# EAGLE design Lights-ctrl rev02 (EAGLE 9.6.2)
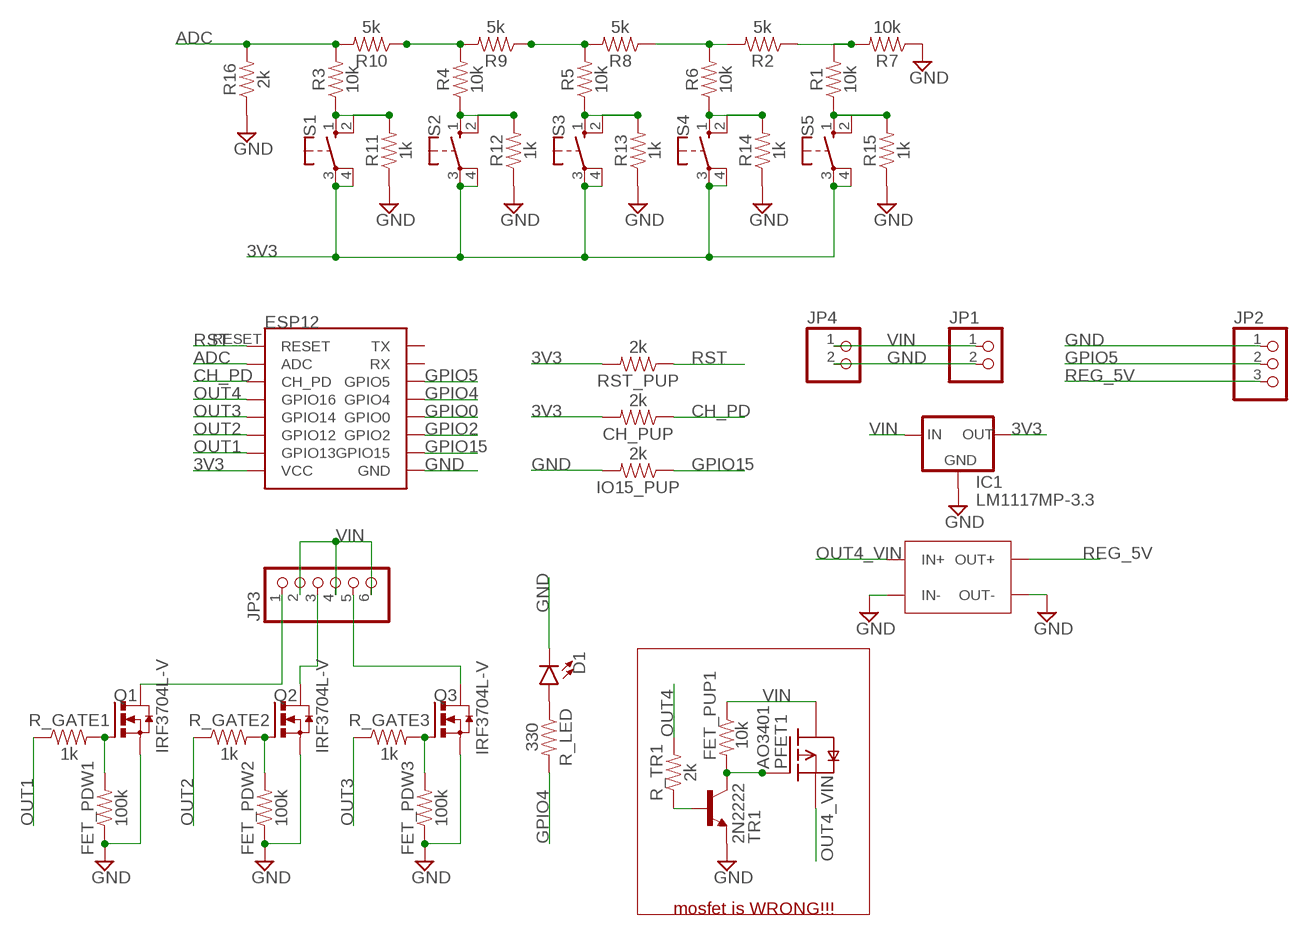
[diagram p0: schematic, sheet 1]

## Parts
CH_PUP  2k  200KOHM-0603-1/10W-1%  [0603]
D1  LED5MM-KIT  [LED_5MM-KIT]
FET_PDW1  100k  200KOHM-0603-1/10W-1%  [0603]
FET_PDW2  100k  200KOHM-0603-1/10W-1%  [0603]
FET_PDW3  100k  200KOHM-0603-1/10W-1%  [0603]
FET_PUP1  10k  200KOHM-0603-1/10W-1%  [0603]
IC1  LM1117MP-3.3  [SOT223]
IO15_PUP  2k  200KOHM-0603-1/10W-1%  [0603]
JP1  PINHD-1X2  [1X02]
JP2  PINHD-1X3  [1X03]
JP3  PINHD-1X6/90  [1X06/90]
JP4  PINHD-1X2  [1X02]
PFET1  AO3401  [SOT23-3]
Q1  IRF3704L-V  [TO262-V]
Q2  IRF3704L-V  [TO262-V]
Q3  IRF3704L-V  [TO262-V]
R1  10k  200KOHM-0603-1/10W-1%  [0603]
R2  5k  200KOHM-0603-1/10W-1%  [0603]
R3  10k  200KOHM-0603-1/10W-1%  [0603]
R4  10k  200KOHM-0603-1/10W-1%  [0603]
R5  10k  200KOHM-0603-1/10W-1%  [0603]
R6  10k  200KOHM-0603-1/10W-1%  [0603]
R7  10k  200KOHM-0603-1/10W-1%  [0603]
R8  5k  200KOHM-0603-1/10W-1%  [0603]
R9  5k  200KOHM-0603-1/10W-1%  [0603]
R10  5k  200KOHM-0603-1/10W-1%  [0603]
R11  1k  200KOHM-0603-1/10W-1%  [0603]
R12  1k  200KOHM-0603-1/10W-1%  [0603]
R13  1k  200KOHM-0603-1/10W-1%  [0603]
R14  1k  200KOHM-0603-1/10W-1%  [0603]
R15  1k  200KOHM-0603-1/10W-1%  [0603]
R16  2k  200KOHM-0603-1/10W-1%  [0603]
R_GATE1  1k  200KOHM-0603-1/10W-1%  [0603]
R_GATE2  1k  200KOHM-0603-1/10W-1%  [0603]
R_GATE3  1k  200KOHM-0603-1/10W-1%  [0603]
R_LED  330  200KOHM-0603-1/10W-1%  [0603]
R_TR1  2k  200KOHM-0603-1/10W-1%  [0603]
RST_PUP  2k  200KOHM-0603-1/10W-1%  [0603]
S1  10-XX  [B3F-10XX]
S2  10-XX  [B3F-10XX]
S3  10-XX  [B3F-10XX]
S4  10-XX  [B3F-10XX]
S5  10-XX  [B3F-10XX]
TR1  2N2222  [SOT23-BEC]
U$1  ESP12E-CASTELLATED  [ESP12E-CASTELLATED]
U$4  XL4005  [XL4005]

## Nets
3V3: CH_PUP.2 IC1.2(OUT) IC1.4(OUT) RST_PUP.2 S1.3(P) S1.4(P1) S2.3(P) S2.4(P1) S3.3(P) S3.4(P1) S4.3(P) S4.4(P1) S5.3(P) S5.4(P1) U$1.VCC
ADC: R3.2 R10.2 R16.2 U$1.ADC
CH_PD: CH_PUP.1 U$1.CH_PD
GND: D1.K(C) FET_PDW1.1 FET_PDW2.1 FET_PDW3.1 IC1.1(GND) IO15_PUP.2 JP1.2 JP2.1 JP4.2 Q1.3(S) Q2.3(S) Q3.3(S) R7.1 R11.1 R12.1 R13.1 R14.1 R15.1 R16.1 TR1.E U$1.GND U$4.IN- U$4.OUT-
GPIO0: U$1.GPIO0
GPIO2: U$1.GPIO2
GPIO4: R_LED.2 U$1.GPIO4
GPIO5: JP2.2 U$1.GPIO5
GPIO15: IO15_PUP.1 U$1.GPIO15
N$1: JP3.1 Q1.2(D)
N$2: R2.2 R6.2 R8.1
N$3: R5.2 R8.2 R9.1
N$4: R4.2 R9.2 R10.1
N$5: D1.A R_LED.1
N$6: R3.1 R11.2 S1.1(S) S1.2(S1)
N$7: R_TR1.1 TR1.B
N$8: FET_PUP1.2 PFET1.1(G) TR1.C
N$10: R1.1 R15.2 S5.1(S) S5.2(S1)
N$12: JP3.3 Q2.2(D)
N$13: JP3.5 Q3.2(D)
N$15: FET_PDW1.2 Q1.1(G) R_GATE1.2
N$16: R1.2 R2.1 R7.2
N$17: R4.1 R12.2 S2.1(S) S2.2(S1)
N$18: FET_PDW2.2 Q2.1(G) R_GATE2.2
N$19: FET_PDW3.2 Q3.1(G) R_GATE3.2
N$20: R5.1 R13.2 S3.1(S) S3.2(S1)
N$21: R6.1 R14.2 S4.1(S) S4.2(S1)
OUT1: R_GATE1.1 U$1.GPIO13
OUT2: R_GATE2.1 U$1.GPIO12
OUT3: R_GATE3.1 U$1.GPIO14
OUT4: R_TR1.2 U$1.GPIO16
OUT4_VIN: PFET1.2(S) U$4.IN+
REG_5V: JP2.3 U$4.OUT+
RST: RST_PUP.1 U$1.RESET
VIN: FET_PUP1.1 IC1.3(IN) JP1.1 JP3.2 JP3.4 JP3.6 JP4.1 PFET1.3(D)
Unconnected: U$1.RX U$1.TX

## Notes on the sheet
- mosfet is WRONG!!!

## Library data of the parts
CH_PUP FET_PDW1-FET_PDW3 FET_PUP1 IO15_PUP R1-R16 R_GATE1-R_GATE3 R_LED R_TR1 RST_PUP = SparkFun-Resistors:200KOHM: 200kΩ resistor A resistor is a passive two-terminal electrical component that implements electrical resistance as a circuit element. Resistors act to reduce current flow, and, at the same time, act to lower voltage levels within circuits. - Wikipedia; PROD_ID: RES-09385; VALUE: 200k
D1 = SparkFun-LED:LED: LED (Generic) Standard schematic elements and footprints for 5mm, 3mm, 1206, and 0603 sized LEDs. Generic LEDs with no color specified.
IC1 = lm1117_10:LM1117?-*: 800mA Low-Dropout Linear Regulator Source: http://www.ti.com/lit/ds/symlink/lm1117-n.pdf; MF: Texas Instruments; MPN: LM1117MP-3.3; OC_FARNELL: 9778195; OC_NEWARK: 28X3416
JP1 JP4 = pinhead:PINHD-1X2: PIN HEADER
JP2 = pinhead:PINHD-1X3: PIN HEADER
JP3 = pinhead:PINHD-1X6: PIN HEADER
PFET1 = AO3401:AO3401: 30V N-Channel MOSFET The AO3404 uses advanced trench technology to provide excellent RDS(ON) and low gate charge. This device may be used as a load switch or in PWM applications. Maximum ratings: Drain-Source Voltage: 30V Gate-Source Voltage: +-20V Continuous Drain Current: 5 (25 C) / 4 (70 C) A Gate Threshold Voltage: 1.2 - 2.4 V Check prices <https://pricing.snapeda.com/parts/AO3401/Alpha%20%26%20Omega%20Semiconductor/view-part?ref=eda>; AVAILABILITY: Bad; DESCRIPTION: P-Channel 30V 4A (Ta) 1.4W (Ta) Surface Mount SOT-23-3L; MF: Alpha & Omega Semiconductor; MP: AO3401; PACKAGE: SOT-23-3 Alpha &amp; Omega Semiconductor; PRICE: None
Q1-Q3 = transistor-power:IRF3704: SMPS MOSFET HEXFET® Power MOSFET Source: http://www.irf.com/product-info/datasheets/data/irf3704.pdf
S1-S5 = switch-omron:10-XX: OMRON SWITCH; MPN: B3F-1000; OC_FARNELL: 176432; OC_NEWARK: 36M3542
TR1 = gabriel:2N2222
U$1 = gabriel:ESP12E-CASTELLATED
U$4 = gabriel:XL4005

## Board
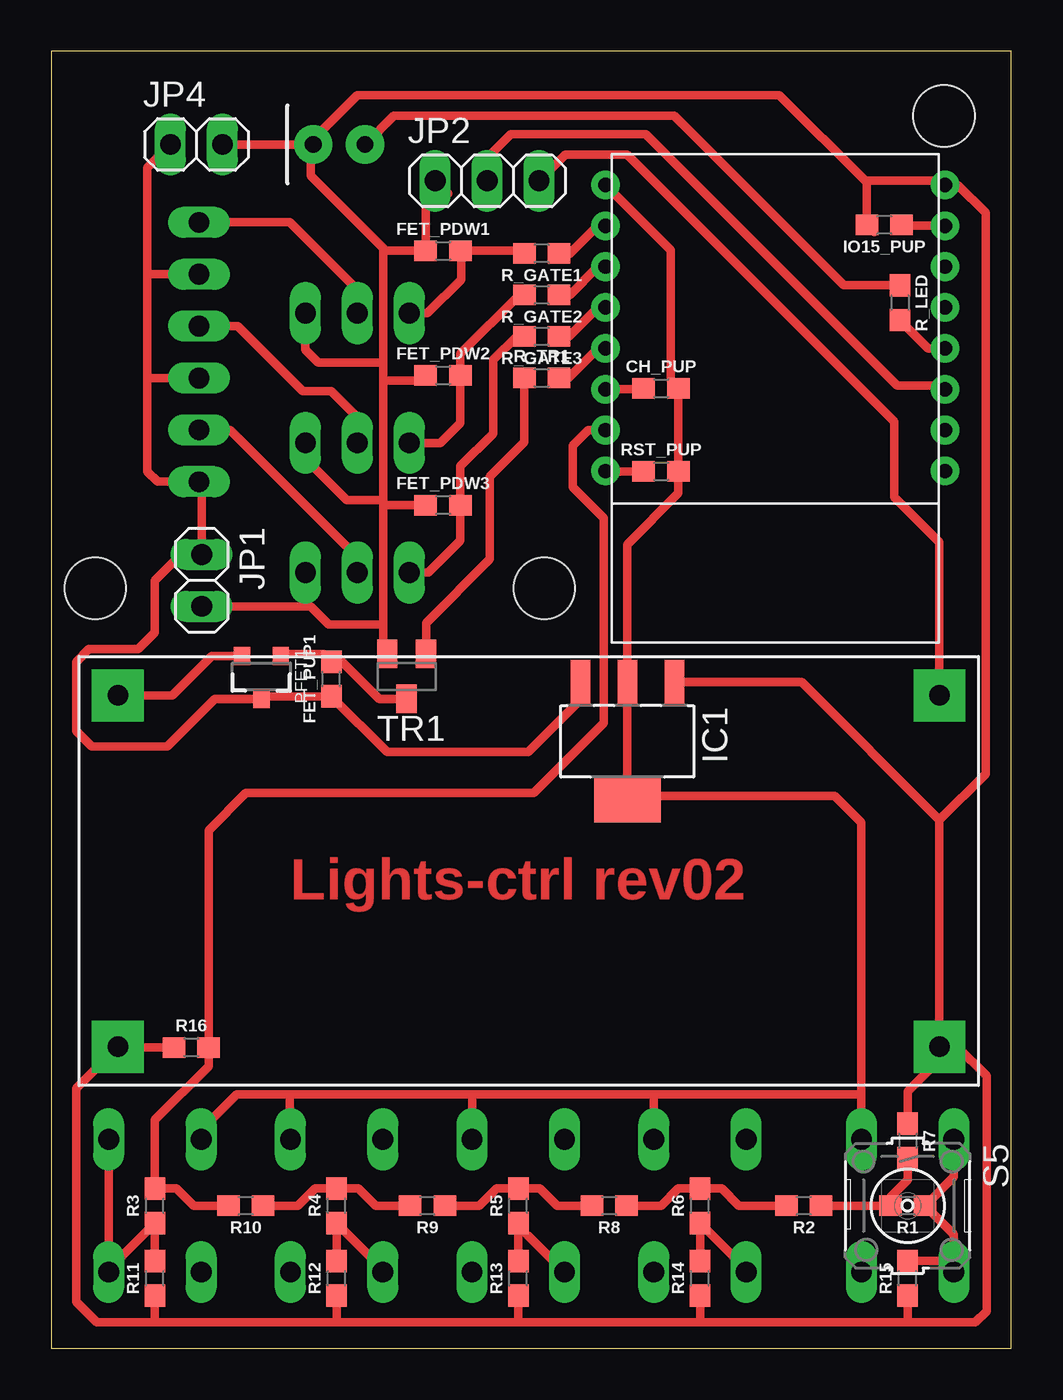
[diagram p1: board, top side]
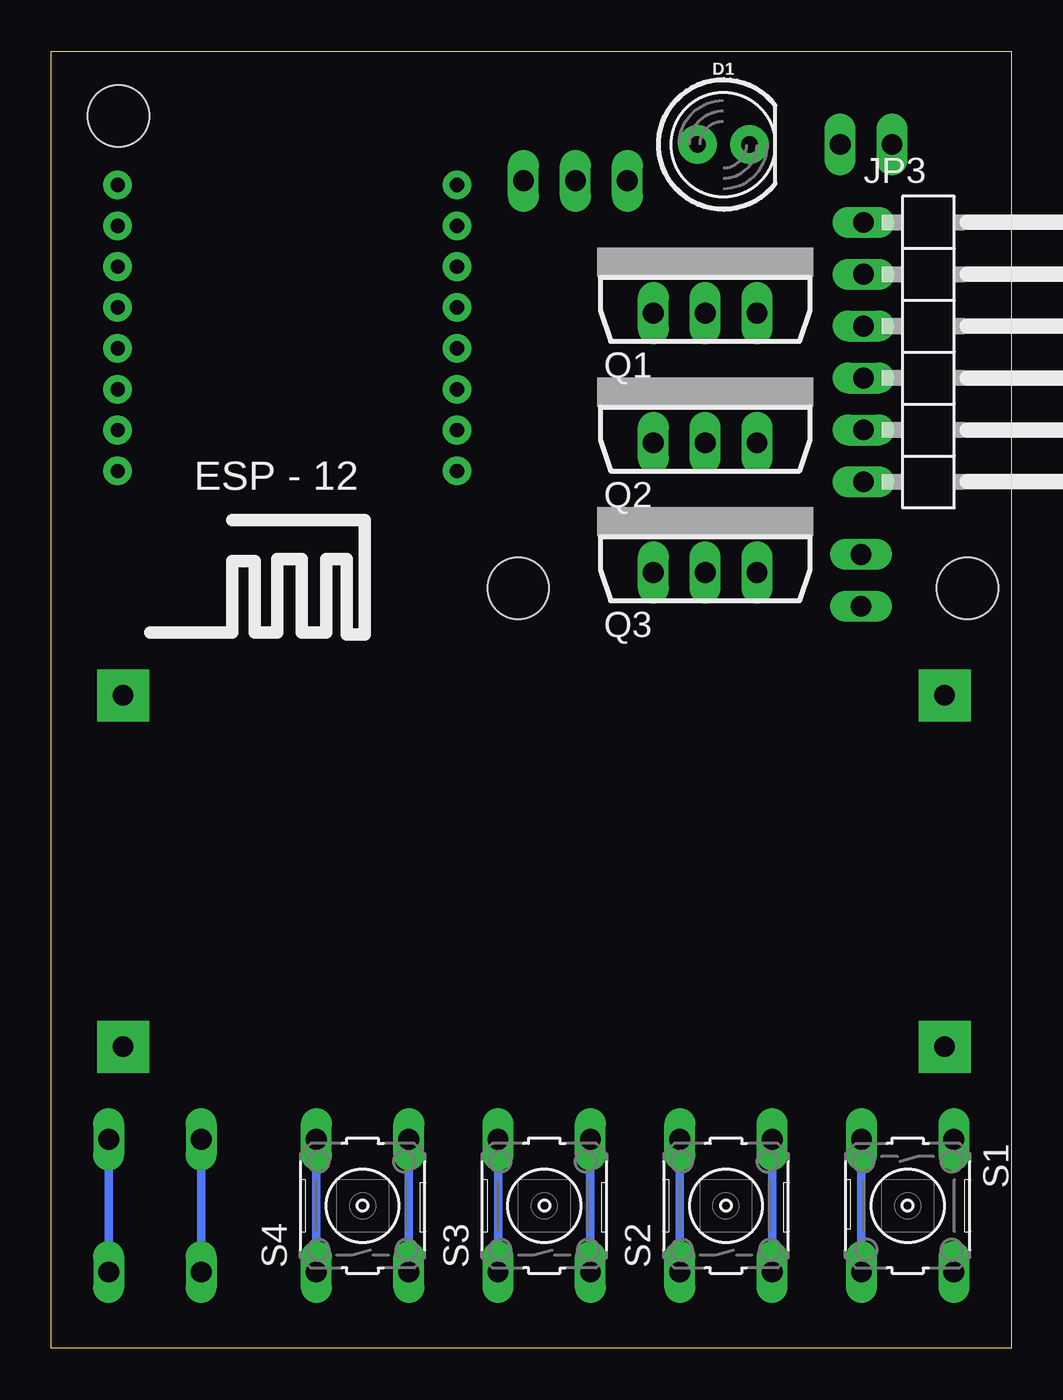
[diagram p2: board, bottom side, seen from below]

Size 46.99 x 63.5 mm. Coordinates in mm from the lower left corner, seen from the top.
Outline: 0,0 46.99,0 46.99,63.5 0,63.5 0,0
Copper layers (1*16): Top 0.035mm / dielectric 1.5mm / Bottom 0.035mm
Design rules "default": minimum track width 6mil, minimum drill 0.35mm, track to track 6mil, track to pad 6mil, pad to pad 6mil, via to via 6mil, smd to smd 6mil, copper to edge 40mil, drill to drill 6mil, minimum pad ring 10mil, minimum via ring 8mil, stop-mask expansion 4mil, vias tented up to drill 0mil, thermal gap 10mil
Holes 3 mm at 24.13,37.21 43.69,60.33 2.16,37.21

### Footprints (pad centres in the part's own frame; a part is rotated, then mirrored left to right if it is on the bottom)
0603 = smd 1.1 x 1: 1 -0.85,0; 2 0.85,0
LED_5MM-KIT = drill 0.813 pad 1.88: A -1.27,0; K 1.27,0
SOT223 = smd 0.95 x 2.15: 1 -2.3,-2.9; 2 0,-2.9; 3 2.3,-2.9 | smd 3.25 x 2.15: 4 0,2.9
1X02 = drill 1.016 long: 1 -1.27,0; 2 1.27,0
1X03 = drill 1.016 long: 1 -2.54,0; 2 0,0; 3 2.54,0
1X06/90 = drill 1.016 long: 1 -6.35,-3.81; 2 -3.81,-3.81; 3 -1.27,-3.81; 4 1.27,-3.81; 5 3.81,-3.81; 6 6.35,-3.81
SOT23-3 = smd 0.8 x 0.9: 1 -0.95,-1; 2 0.95,-1; 3 0,1.1
TO262-V = drill 1.016 long: 1 -2.54,0; 2 0,0; 3 2.54,0
B3F-10XX = drill 1.016 long: 1 -3.251,2.261; 2 3.251,2.261; 3 -3.251,-2.261; 4 3.251,-2.261
SOT23-BEC = smd 1 x 1.4: B -0.95,-1.1; C 0,1.1; E 0.95,-1.1
ESP12E-CASTELLATED = drill 0.7 pad 1.4: ADC -8.3,0.9; CH_PD -8.3,-1.1; GND 8.3,-11.1; GPIO0 8.3,-5.1; GPIO2 8.3,-7.1; GPIO4 8.3,-3.1; GPIO5 8.3,-1.1; GPIO12 -8.3,-7.1; GPIO13 -8.3,-9.1; GPIO14 -8.3,-5.1; GPIO15 8.3,-9.1; GPIO16 -8.3,-3.1; RESET -8.3,2.9; RX 8.3,0.9; TX 8.3,2.9; VCC -8.3,-11.1
XL4005 = drill 1 pad 2.54 square: IN+ -20.1,8.6; IN- -20.1,-8.6; OUT+ 20.1,8.6; OUT- 20.1,-8.6

### Placement (x,y rotation side)
CH_PUP  29.84,46.99 0 top
D1  14.1,58.93 0 bottom
FET_PDW1  19.18,53.72 0 top
FET_PDW2  19.18,47.62 0 top
FET_PDW3  19.18,41.27 0 top
FET_PUP1  13.72,32.77 90 top
IC1  28.19,29.72 180 top
IO15_PUP  40.77,54.99 180 top
JP1  7.37,37.59 270 top
JP2  21.34,57.15 0 top
JP3  3.43,48.77 270 bottom
JP4  7.11,58.93 0 top
PFET1  10.29,32.89 180 top
Q1  14.99,50.67 0 bottom
Q2  14.99,44.32 0 bottom
Q3  14.99,37.97 0 bottom
R1  41.91,6.99 180 top
R2  36.83,6.99 180 top
R3  5.08,6.99 90 top
R4  13.97,6.99 90 top
R5  22.86,6.99 90 top
R6  31.75,6.99 90 top
R7  41.91,10.16 270 top
R8  27.3,6.99 180 top
R9  18.41,6.99 180 top
R10  9.53,6.99 180 top
R11  5.08,3.43 90 top
R12  13.97,3.43 90 top
R13  22.86,3.43 90 top
R14  31.75,3.43 90 top
R15  41.91,3.43 90 top
R16  6.86,14.73 0 top
R_GATE1  24,53.59 180 top
R_GATE2  24,51.56 180 top
R_GATE3  24,49.53 180 top
R_LED  41.53,51.18 270 top
R_TR1  24,47.5 0 top
RST_PUP  29.84,42.93 0 top
S1  5.08,6.99 270 bottom
S2  13.97,6.99 90 bottom
S3  22.86,6.99 90 bottom
S4  31.75,6.99 90 bottom
S5  41.91,6.99 270 top
TR1  17.4,32.89 180 top
U$1  35.43,45.85 180 bottom
U$4  23.37,23.37 0 top

### Tracks (layer width: path | path; a pad name or v marks a point on that pad's centre or on a via)
3V3
  Top 0.406: U$1.VCC 30.31,53.77 30.31,47.37 CH_PUP.2 RST_PUP.2 30.7,41.86 28.19,39.36 IC1.2 IC1.4 28.43,27.05 38.35,27.05 39.65,25.76 39.65,12.45 | 12.14,10.24 S2.4 11.68,10.26 11.68,12.45 | S1.3 7.11,10.46 9.09,12.45 11.68,12.45 | S5.3 39.65,12.45 | 29.49,10.26 S4.4 29.49,12.42 29.46,12.45 | 39.65,12.45 29.46,12.45 | 20.6,12.45 11.68,12.45 | S3.4 20.6,12.45 | 29.46,12.45 20.6,12.45
  Bottom 0.406: S3.4 S3.3 | S4.4 S4.3 | S2.4 S2.3 | S5.3 S5.4 | S1.3 S1.4
ADC
  Top 0.406: U$1.ADC 27.05,44.95 27.04,44.96 26.29,44.96 25.53,44.2 25.53,42.16 27.05,40.64 27.05,30.61 23.62,27.18 9.53,27.18 7.71,25.36 R16.2 7.71,13.8 5.08,11.18 R3.2 6.13,7.83 6.99,6.99 R10.2
CH_PD
  Top 0.406: CH_PUP.1 28.95,46.95 U$1.CH_PD
GND
  Top 0.406: IO15_PUP.2 40.27,54.63 | IO15_PUP.2 39.79,55.12 | 6.73,36.32 JP1.2 12.7,36.32 | R7.1 41.91,12.57 43.09,13.75 43.09,14.39 U$4.OUT- | R11.1 5.08,1.27 | 13.97,1.27 22.86,1.27 | 22.86,1.27 31.75,1.27 | 31.75,1.27 41.91,1.27 | 41.91,1.27 45.21,1.27 45.77,1.83 45.77,13.34 44.34,14.77 U$4.OUT- | R13.1 22.86,1.27 | R14.1 31.75,1.27 | R15.1 41.91,1.27 | 13.97,1.27 5.08,1.27 | R12.1 13.97,1.27 | U$4.OUT- 43.47,25.87 | 43.47,25.87 36.72,32.62 IC1.1 | 43.47,25.87 45.72,28.13 45.72,55.59 44.37,56.95 U$1.GND 43.53,57.15 39.83,57.15 | 5.08,1.27 2.23,1.27 1.22,2.29 1.22,12.72 U$4.IN- 3.3,14.73 R16.1 | Q1.3 12.45,48.9 13.08,48.26 16.26,48.26 | 16.26,41.53 14.48,41.53 12.45,43.56 Q2.3 | 16.26,53.85 12.7,57.4 12.7,58.8 D1.K | JP4.2 D1.K | D1.K 12.83,59.18 14.99,61.34 35.64,61.34 39.83,57.15 | IO15_PUP.2 39.92,57.06 39.83,57.15 | 19.43,56.52 JP2.1 18.33,56.68 FET_PDW1.1 16.38,53.72 16.26,53.85 | FET_PDW2.1 18.07,47.37 16.26,47.37 | 16.26,47.37 | 16.26,47.37 16.26,48.26 | 16.26,47.37 | 16.26,47.37 16.26,41.53 | Q3.3 12.57,37.85 12.57,36.45 12.7,36.32 | 12.7,36.32 13.59,35.43 16.26,35.43 | 16.26,41.27 16.26,34.19 TR1.E | 16.26,41.53 16.26,41.27 | FET_PDW3.1 16.26,41.27 | 16.26,53.85 16.26,48.26
GPIO4
  Top 0.406: U$1.GPIO4 42.91,48.95 R_LED.2
GPIO5
  Top 0.406: U$1.GPIO5 43.56,47.12 41.41,47.12 29.09,59.44 22.48,59.44 21.34,58.29 JP2.2
GPIO15
  Top 0.406: U$1.GPIO15 41.66,54.95 IO15_PUP.1
N$1
  Top 0.406: Q1.2 14.99,51.82 11.68,55.12 JP3.1
N$2
  Top 0.406: R8.1 29.84,6.99 30.7,7.83 R6.2 32.8,7.83 33.66,6.99 R2.2
N$3
  Top 0.406: R8.2 24.77,6.99 23.91,7.83 R5.2 21.8,7.83 20.95,6.99 R9.1
N$4
  Top 0.406: R9.2 15.88,6.99 15.03,7.83 R4.2 12.91,7.83 12.06,6.99 R10.1
N$5
  Top 0.406: R_LED.1 38.77,52.03 30.48,60.33 16.76,60.33 D1.A
N$6
  Top 0.406: S1.1 S1.2 2.82,3.86 5.08,6.12 R3.1 R11.2
N$7
  Top 0.406: R_TR1.1 23.15,44.36 21.46,42.67 21.46,38.63 18.35,35.52 TR1.B
N$8
  Top 0.406: PFET1.1 11.34,34 13.34,34 FET_PUP1.2 14.22,33.62 16.05,31.79 TR1.C
N$10
  Top 0.406: S5.1 44.17,8.4 R1.1 44.17,5.57 S5.2 43.62,4.28 R15.2
  Bottom 0.406: S5.1 S5.2
N$12
  Top 0.406: Q2.2 14.99,45.59 13.72,46.86 12.32,46.86 9.14,50.04 JP3.3
N$13
  Top 0.406: Q3.2 14.99,38.73 8.76,44.96 JP3.5
N$15
  Top 0.406: R_GATE1.2 23.03,53.72 FET_PDW1.2 20.07,53.68 20.07,52.32 18.41,50.67 Q1.1
N$16
  Top 0.406: R2.1 R1.2 41.06,7.41 41.91,8.26 R7.2
N$17
  Top 0.406: S2.1 16.23,3.87 R4.1 R12.2
  Bottom 0.406: S2.2 S2.1
N$18
  Top 0.406: Q2.1 19.05,44.32 20.03,45.3 FET_PDW2.2 20.03,48.69 22.9,51.56 R_GATE2.2
N$19
  Top 0.406: R_GATE3.2 22.77,49.53 21.63,48.39 21.63,44.78 20.03,43.18 FET_PDW3.2 20.03,39.55 18.45,37.97 Q3.1
N$20
  Top 0.406: S3.1 23.32,5.53 22.73,6 R5.1 R13.2
  Bottom 0.406: S3.2 S3.1
N$21
  Top 0.406: R6.1 31.96,5.92 | 31.96,5.92 34.01,3.87 S4.1 | R14.2 31.75,5.71 31.96,5.92
  Bottom 0.406: S4.1 S4.2
OUT1
  Top 0.406: R_GATE1.1 24.9,53.55 25.36,53.55 26.75,54.95 U$1.GPIO13
OUT2
  Top 0.406: U$1.GPIO12 26.75,52.95 25.37,51.56 R_GATE2.1
OUT3
  Top 0.406: U$1.GPIO14 26.75,50.95 25.34,49.53 R_GATE3.1
OUT4
  Top 0.406: R_TR1.2 25.3,47.5 26.75,48.95 U$1.GPIO16
OUT4_VIN
  Top 0.406: PFET1.2 7.86,33.89 5.93,31.97 U$4.IN+
REG_5V
  Top 0.406: U$4.OUT+ 43.47,39.46 41.25,41.67 41.25,45.36 28.19,58.42 25.15,58.42 JP2.3
RST
  Top 0.406: U$1.RESET 27.15,42.93 RST_PUP.1
VIN
  Top 0.406: IC1.3 25.89,31.73 23.35,29.19 16.44,29.19 FET_PUP1.1 10.41,31.92 PFET1.3 8,31.79 5.67,29.46 1.98,29.46 1.22,30.23 1.22,33.6 1.84,34.23 4.25,34.23 5.08,35.05 5.08,37.59 6.35,38.86 JP1.1 7.37,42.29 JP3.6 5.21,42.42 4.7,42.93 4.7,47.5 | 4.7,47.5 4.7,52.58 | 4.7,52.58 JP3.2 | 4.7,52.58 4.7,57.78 JP4.1 | JP3.4 4.7,47.5

### Text on the board
Document: step down is in the wrong side!! / ao3401 is wrong